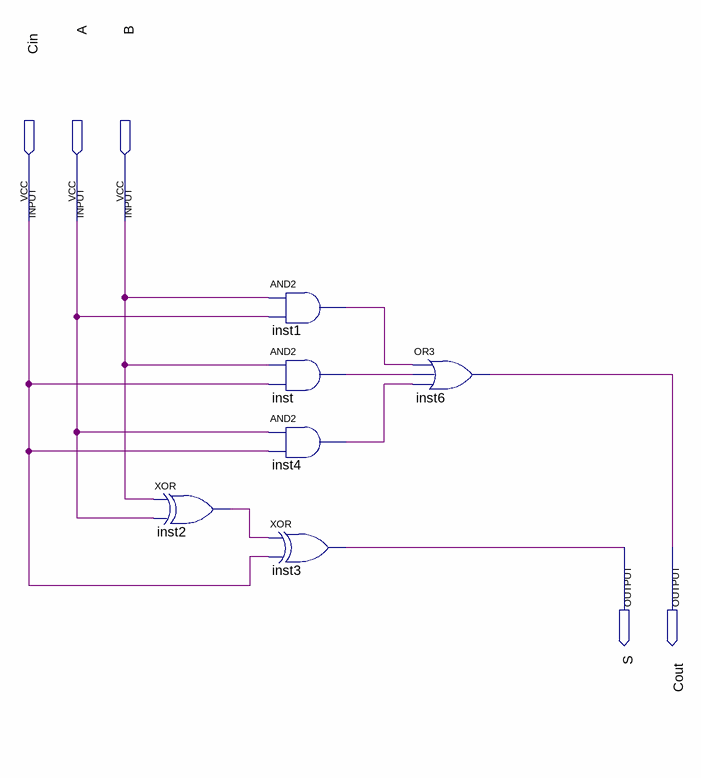
[diagram p0: schematic sheet]
// Quartus schematic Add18its.bdf as structural Verilog: 6 symbols, 5 pins
module Add18its (
  input  Cin,
  input  A,
  input  B,
  output S,
  output Cout
);

  wire inst1_out, inst2_out, inst4_out, inst_out;

  xor inst2 (inst2_out, B, A);
  and inst1 (inst1_out, B, A);
  and inst (inst_out, B, Cin);
  and inst4 (inst4_out, A, Cin);
  xor inst3 (S, inst2_out, Cin);
  or inst6 (Cout, inst1_out, inst_out, inst4_out);
endmodule
